# Altium project PCB_1.PrjPcb
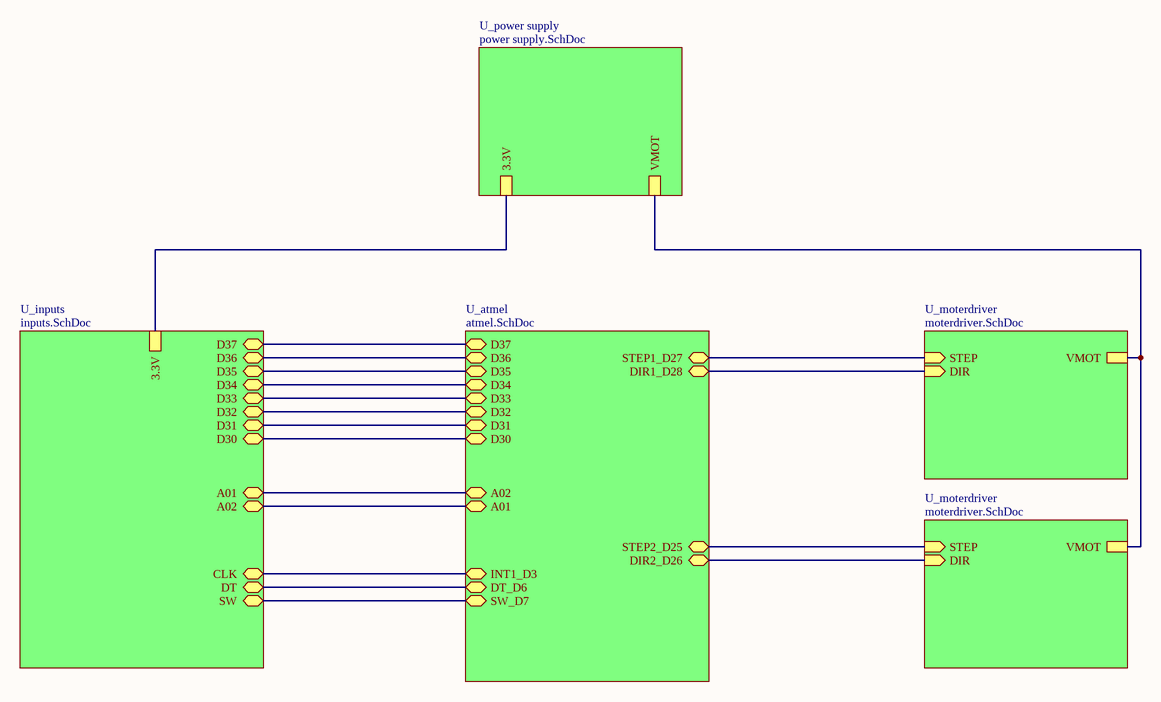
[diagram p0: Main.SchDoc]
5 sheets, 33 parts. Net scope: hierarchical (ports join the sheet entries above them; power ports are global).
Board file: PCB1.PcbDoc
Sheets:
  Main.SchDoc
    U_power supply = power supply.SchDoc
    U_atmel = atmel.SchDoc
    U_inputs = inputs.SchDoc
    U_moterdriver = moterdriver.SchDoc
    U_moterdriver = moterdriver.SchDoc

## Sheet Main.SchDoc: PCB design of fabric rolling machine
size A4; SheetNumber: 1; SheetTotal: 5

### Sub-sheets
U_atmel = atmel.SchDoc: D37 (bidir), D36 (bidir), D35 (bidir), D34 (bidir), D33 (bidir), D32 (bidir), D31 (bidir), D30 (bidir), A02 (bidir), A01 (bidir), STEP2_D25 (bidir), DIR2_D26 (bidir), STEP1_D27 (bidir), DIR1_D28 (bidir), INT1_D3 (bidir), DT_D6 (bidir), SW_D7 (bidir)
U_inputs = inputs.SchDoc: D30 (bidir), D31 (bidir), D32 (bidir), D33 (bidir), D34 (bidir), D35 (bidir), D36 (bidir), D37 (bidir), A01 (bidir), A02 (bidir), CLK (bidir), SW (bidir), 3.3V, DT (bidir)
U_moterdriver = moterdriver.SchDoc: VMOT, STEP (in), DIR (in)
U_moterdriver = moterdriver.SchDoc: VMOT, STEP (in), DIR (in)
U_power supply = power supply.SchDoc: 3.3V, VMOT

### Nets
NetC1_1: sheet U_power supply/VMOT, sheet U_moterdriver/VMOT, sheet U_moterdriver/VMOT
NetC4_1: sheet U_power supply/3.3V, sheet U_inputs/3.3V
NetEncoder_1: sheet U_atmel/INT1_D3, sheet U_inputs/CLK
NetEncoder_2: sheet U_atmel/DT_D6, sheet U_inputs/DT
NetEncoder_3: sheet U_atmel/SW_D7, sheet U_inputs/SW
NetKeyboard_1: sheet U_atmel/D30, sheet U_inputs/D30
NetKeyboard_2: sheet U_atmel/D31, sheet U_inputs/D31
NetKeyboard_3: sheet U_atmel/D32, sheet U_inputs/D32
NetKeyboard_4: sheet U_atmel/D33, sheet U_inputs/D33
NetKeyboard_5: sheet U_atmel/D34, sheet U_inputs/D34
NetKeyboard_6: sheet U_atmel/D35, sheet U_inputs/D35
NetKeyboard_7: sheet U_atmel/D36, sheet U_inputs/D36
NetKeyboard_8: sheet U_atmel/D37, sheet U_inputs/D37
NetLCD_2: sheet U_atmel/A02, sheet U_inputs/A01
NetLCD_3: sheet U_atmel/A01, sheet U_inputs/A02
NetU3_72: sheet U_atmel/DIR1_D28, sheet U_moterdriver/DIR
NetU3_73: sheet U_atmel/STEP1_D27, sheet U_moterdriver/STEP
NetU3_74: sheet U_atmel/DIR2_D26, sheet U_moterdriver/DIR
NetU3_75: sheet U_atmel/STEP2_D25, sheet U_moterdriver/STEP

## Sheet power supply.SchDoc
size A4; SheetNumber: 2; SheetTotal: 5
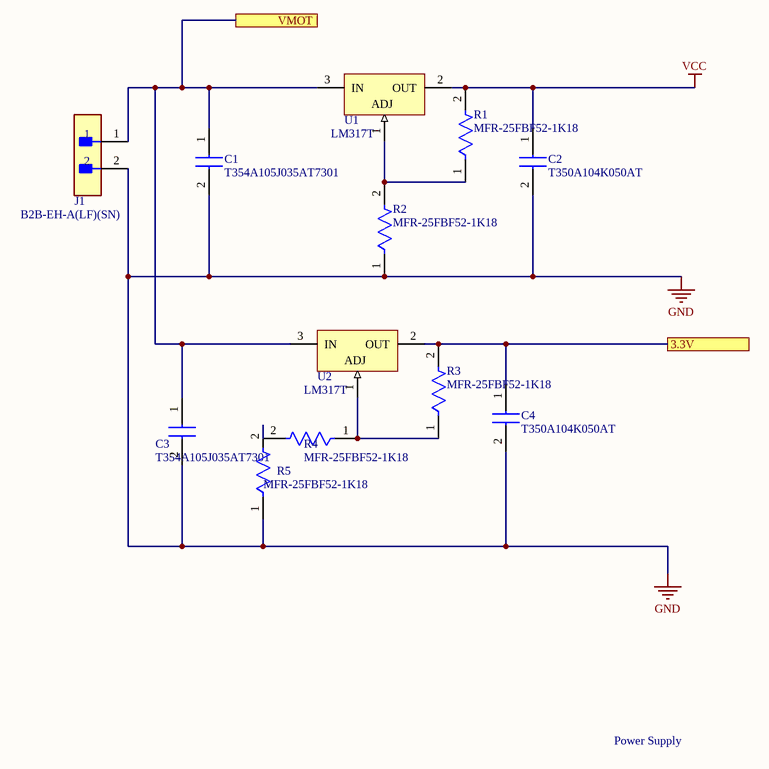
[diagram p1: power supply.SchDoc]

### Parts
C1  T354A105J035AT7301  [T354A105J035AT7301]
C2  T350A104K050AT  [T350A104K050AT]
C3  T354A105J035AT7301  [T354A105J035AT7301]
C4  T350A104K050AT  [T350A104K050AT]
J1  B2B-EH-A(LF)(SN)  [FP-B2B-EH-A_LF_SN-MFG]
R1  MFR-25FBF52-1K18  [FP-MFR-25-MFG]
R2  MFR-25FBF52-1K18  [FP-MFR-25-MFG]
R3  MFR-25FBF52-1K18  [FP-MFR-25-MFG]
R4  MFR-25FBF52-1K18  [FP-MFR-25-MFG]
R5  MFR-25FBF52-1K18  [FP-MFR-25-MFG]
U1  LM317T  [NDE0003A]
U2  LM317T  [NDE0003A]

### Ports
3.3V, VMOT

### Nets
GND: C1.2(-) C2.2 C3.2(-) C4.2 J1.2 R2.1 R5.1
VCC: C2.1 R1.2 U1.2(OUT)
NetC1_1: C1.1(+) C3.1(+) J1.1 U1.3(IN) U2.3(IN) ; port VMOT
NetC4_1: C4.1 R3.2 U2.2(OUT) ; port 3.3V
NetR1_1: R1.1 R2.2 U1.1(ADJ)
NetR3_1: R3.1 R4.1 U2.1(ADJ)
NetR4_2: R4.2 R5.2

### Notes on the sheet
- Power Supply

### Library data of the parts
C1 C3 = T354A105J035AT7301: Capacitor; Manufacturer_Name: KEMET; Datasheet Link: https://content.kemet.com/datasheets/KEM_T2043_T35X.pdf; Height: 8.6mm; Manufacturer_Part_Number: T354A105J035AT7301; Mouser Part Number: 80-T354A105J35AT-TR; Mouser Price/Stock: https://www.mouser.co.uk/ProductDetail/KEMET/T354A105J035AT7301?qs=eaG68hM7nzPCdlzS1u%252BjMg%3D%3D
C2 C4 = T350A104K050AT: Capacitor; Manufacturer_Name: KEMET; Datasheet Link: https://content.kemet.com/datasheets/KEM_T2043_T35X.pdf; Height: 7.1mm; Manufacturer_Part_Number: T350A104K050AT; Mouser Part Number: 80-T350A104K50AT; Mouser Price/Stock: https://www.mouser.co.uk/ProductDetail/KEMET/T350A104K050AT?qs=O4djsYW3Gvb%252Bsic1QYKKdw%3D%3D; Arrow Part Number: T350A104K050AT; Arrow Price/Stock: https://www.arrow.com/en/products/t350a104k050at/kemet-corporation?region=nac
J1 = CMP-17439-000026-1: CONN HEADER VERT 2POS 2.5MM; Number of Contacts: 2; Current Rating: 3A; Connector Type: Plug; Contact Resistance: 20mR; Gender: Male; Voltage Rating: 250V; Fastening Type: Detent; Depth: 3.8mm; Max Operating Temperature: 85°C; Orientation: Straight; Series: EH; Contact Plating: Tin; Min Operating Temperature: -25°C; Contact Type: Male Pin; Housing Color: White; Termination: Press-Fit; Housing Material: Nylon; Pitch: 2.5mm; Number of Positions: 2; Max Current Rating: 3A; Packaging: Bulk; Lead Free: Lead Free; Number of Rows: 1; Length: 7.5mm; Contact Mating Length: 0.13inch; Color: Natural; Max Voltage Rating (AC): 250V; Contact Material: Copper Alloy; Mount: Through Hole
R1-R5 = CMP-03413-000001-1: RES 1.18K OHM 1/4W 1% AXIAL; Manufacturer: Yageo; Value: 1.18kΩ; Temperature Coefficient: 100ppm/°C; Power Rating: 0.25W; Voltage Rating: 250V; Temperature: -55°C to +155°C; Automotive: No; Temperature Range High: +155°C; Mouser Description: Metal Film Resistors 1.18K OHM 1/4W 1%; Digikey Description: RES 1.18K OHM 1/4W 1% AXIAL; Lead Free: Yes; Tolerance: 1%; ComponentLink2Description: Datasheet; ComponentLink2URL: https://www.yageo.com/upload/media/product/products/datasheet/lr/Yageo_LR_MFR_1.pdf; Temperature Range Low: -55°C; Package: MFR-25; Ipc Land Pattern Name: RESAD1000W75L680D260; Composition: Metal Film; Category: Res; Octopart: https://octopart.com/mfr-25fbf52-1k18-yageo-56251681; Series: MFR; Device Class L2: Resistors; Height: 2.6mm; Resistance: 1.18kΩ; Device Class L3: Through-Hole Resistors; Manufacturer Part Number: MFR-25FBF52-1K18; RoHS: TRUE; Device Class L1: Passive Components
U1 U2 = CMP-0062-02456-3: 3-Terminal Adjustable Regulator, 3-pin TO-220; Manufacturer: Texas Instruments; CompType: LDO IC; PowerWise: N; PackageTopMarking: NSUZXYTTE#*LM317T P+; ComponentLink1Description: Datasheet URL; PackageReference: NDE0003A; PinCount: 3; ComponentLink1URL: http://www.ti.com/general/docs/lit/getliterature.tsp?genericPartNumber=LM317-N&fileType=pdf; RoHS: N; PackageDescription: TO-220, Molded, 3 Lead, Straight

## Sheet atmel.SchDoc
size A4; SheetNumber: 3; SheetTotal: 5
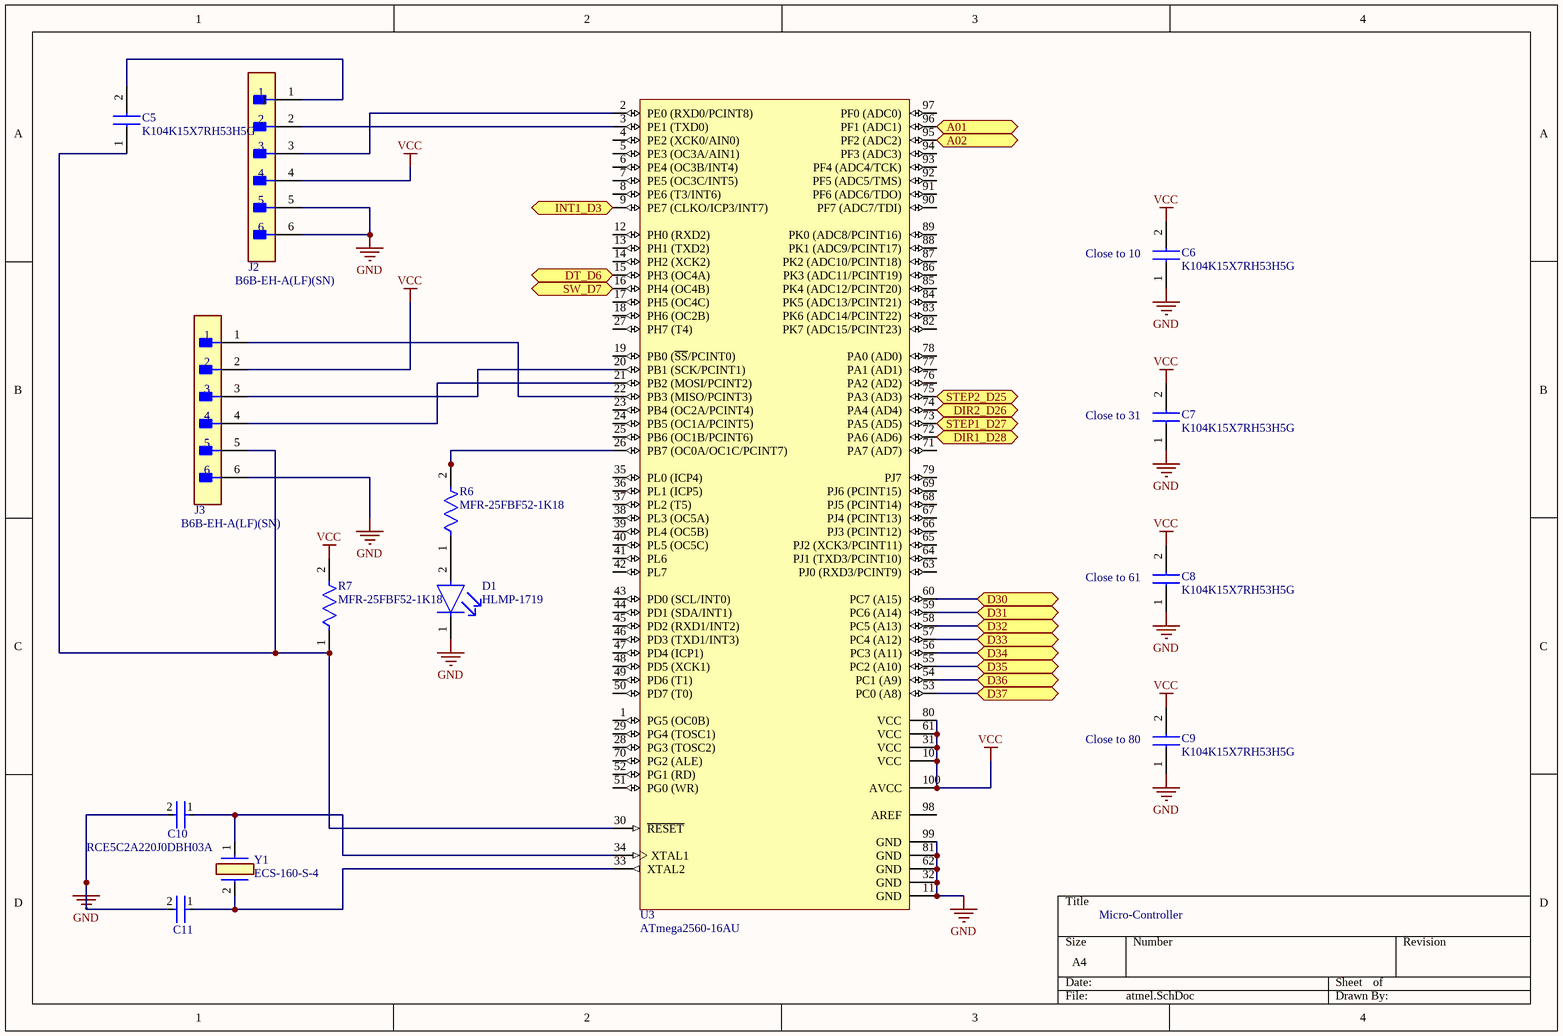
[diagram p2: atmel.SchDoc]

### Parts
C5  K104K15X7RH53H5G  [K104K15X7RH53H5G]
C6  K104K15X7RH53H5G  [K104K15X7RH53H5G]
C7  K104K15X7RH53H5G  [K104K15X7RH53H5G]
C8  K104K15X7RH53H5G  [K104K15X7RH53H5G]
C9  K104K15X7RH53H5G  [K104K15X7RH53H5G]
C10  RCE5C2A220J0DBH03A  [FP-RCE0DB-MFG]
C11  RCE5C2A220J0DBH03A  [FP-RCE0DB-MFG]  (value not drawn)
D1  HLMP-1719  [FP-HLMP-1719-MFG]
J2  B6B-EH-A(LF)(SN)  [FP-B6B-EH-A_LF_SN-MFG]
J3  B6B-EH-A(LF)(SN)  [FP-B6B-EH-A_LF_SN-MFG]
R6  MFR-25FBF52-1K18  [FP-MFR-25-MFG]
R7  MFR-25FBF52-1K18  [FP-MFR-25-MFG]
U3  ATmega2560-16AU  [100A_M]
Y1  ECS-160-S-4  [ECS160S4]

### Ports
A01 (bidir), A02 (bidir), D30 (bidir), D31 (bidir), D32 (bidir), D33 (bidir), D34 (bidir), D35 (bidir), D36 (bidir), D37 (bidir), DIR1_D28 (bidir), DIR2_D26 (bidir), DT_D6 (bidir), INT1_D3 (bidir), STEP1_D27 (bidir), STEP2_D25 (bidir), SW_D7 (bidir)

### Nets
GND: C6.1 C7.1 C8.1 C9.1 C10.2 C11.2 D1.1(C) J2.5 J2.6 J3.6 U3.11(GND) U3.32(GND) U3.62(GND) U3.81(GND) U3.99(GND)
VCC: C6.2 C7.2 C8.2 C9.2 J2.4 J3.2 R7.2 U3.10(VCC) U3.31(VCC) U3.61(VCC) U3.80(VCC) U3.100(AVCC)
NetC5_1: C5.1 J3.5 R7.1 U3.30(~{RESET})
NetC5_2: C5.2 J2.1
NetC10_1: C10.1 U3.34(XTAL1) Y1.1
NetC11_1: C11.1 U3.33(XTAL2) Y1.2
NetD1_2: D1.2(A) R6.1
NetEncoder_1: U3.9(PE7_(CLKO/ICP3/INT7)) ; port INT1_D3
NetEncoder_2: U3.15(PH3_(OC4A)) ; port DT_D6
NetEncoder_3: U3.16(PH4_(OC4B)) ; port SW_D7
NetJ2_2: J2.2 U3.3(PE1_(TXD0))
NetJ2_3: J2.3 U3.2(PE0_(RXD0/PCINT8))
NetJ3_1: J3.1 U3.22(PB3_(MISO/PCINT3))
NetJ3_3: J3.3 U3.20(PB1_(SCK/PCINT1))
NetJ3_4: J3.4 U3.21(PB2_(MOSI/PCINT2))
NetKeyboard_1: U3.60(PC7_(A15)) ; port D30
NetKeyboard_2: U3.59(PC6_(A14)) ; port D31
NetKeyboard_3: U3.58(PC5_(A13)) ; port D32
NetKeyboard_4: U3.57(PC4_(A12)) ; port D33
NetKeyboard_5: U3.56(PC3_(A11)) ; port D34
NetKeyboard_6: U3.55(PC2_(A10)) ; port D35
NetKeyboard_7: U3.54(PC1_(A9)) ; port D36
NetKeyboard_8: U3.53(PC0_(A8)) ; port D37
NetLCD_2: U3.95(PF2_(ADC2)) ; port A02
NetLCD_3: U3.96(PF1_(ADC1)) ; port A01
NetR6_2: R6.2 U3.26(PB7_(OC0A/OC1C/PCINT7))
NetU3_72: U3.72(PA6_(AD6)) ; port DIR1_D28
NetU3_73: U3.73(PA5_(AD5)) ; port STEP1_D27
NetU3_74: U3.74(PA4_(AD4)) ; port DIR2_D26
NetU3_75: U3.75(PA3_(AD3)) ; port STEP2_D25

Not connected (* = marked no-connect by the designer): U3 1(PG5_(OC0B)) 4(PE2_(XCK0/AIN0)) 5(PE3_(OC3A/AIN1)) 6(PE4_(OC3B/INT4)) 7(PE5_(OC3C/INT5)) 8(PE6_(T3/INT6)) 12(PH0_(RXD2)) 13(PH1_(TXD2)) 14(PH2_(XCK2)) 17(PH5_(OC4C)) 18(PH6_(OC2B)) 19(PB0_(~{SS}/PCINT0)) 23(PB4_(OC2A/PCINT4)) 24(PB5_(OC1A/PCINT5)) 25(PB6_(OC1B/PCINT6)) 27(PH7_(T4)) 28(PG3_(TOSC2)) 29(PG4_(TOSC1)) 35(PL0_(ICP4)) 36(PL1_(ICP5)) 37(PL2_(T5)) 38(PL3_(OC5A)) 39(PL4_(OC5B)) 40(PL5_(OC5C)) 41(PL6) 42(PL7) 43(PD0_(SCL/INT0)) 44(PD1_(SDA/INT1)) 45(PD2_(RXD1/INT2)) 46(PD3_(TXD1/INT3)) 47(PD4_(ICP1)) 48(PD5_(XCK1)) 49(PD6_(T1)) 50(PD7_(T0)) 51(PG0_(WR)) 52(PG1_(RD)) 63(PJ0_(RXD3/PCINT9)) 64(PJ1_(TXD3/PCINT10)) 65(PJ2_(XCK3/PCINT11)) 66(PJ3_(PCINT12)) 67(PJ4_(PCINT13)) 68(PJ5_(PCINT14)) 69(PJ6_(PCINT15)) 70(PG2_(ALE)) 71(PA7_(AD7)) 76(PA2_(AD2)) 77(PA1_(AD1)) 78(PA0_(AD0)) 79(PJ7) 82(PK7_(ADC15/PCINT23)) 83(PK6_(ADC14/PCINT22)) 84(PK5_(ADC13/PCINT21)) 85(PK4_(ADC12/PCINT20)) 86(PK3_(ADC11/PCINT19)) 87(PK2_(ADC10/PCINT18)) 88(PK1_(ADC9/PCINT17)) 89(PK0_(ADC8/PCINT16)) 90(PF7_(ADC7/TDI)) 91(PF6_(ADC6/TDO)) 92(PF5_(ADC5/TMS)) 93(PF4_(ADC4/TCK)) 94(PF3_(ADC3)) 97(PF0_(ADC0)) 98(AREF)

### Notes on the sheet
- (near C6) Close to 10
- (near C7) Close to 31
- (near C8) Close to 61
- (near C9) Close to 80
- Micro-Controller

### Library data of the parts
C5-C9 = K104K15X7RH53H5G: Capacitor; Manufacturer_Name: Vishay; Datasheet Link: https://www.vishay.com/docs/45250/kgseries.pdf; Height: 6.4mm; Manufacturer_Part_Number: K104K15X7RH53H5G; Mouser Part Number: 594-K104K15X7RH53H5G; Mouser Price/Stock: https://www.mouser.co.uk/ProductDetail/Vishay-BC-Components/K104K15X7RH53H5G?qs=DPoM0jnrROVmsAlOWkFXbA%3D%3D
C10 C11 = CMP-06035-047347-1: Cap Ceramic 22pF 100V C0G ±5% Radial 2.5mm +125°C Ammo Pack; Lead Diameter: 0.5mm; Lead/Base Style: Straight; Height: 3.5mm; Voltage: 100V; Mount: Through Hole; Min Operating Temperature: -55°C; Height - Seated (Max): 0.138inch; Dielectric: C0G; Width: 0.098inch; Depth: 2.5mm; Lead Pitch: 0.098inch; Packaging: Tape and Reel; Voltage Rating (DC): 100V; Capacitance: 22pF; Package Quantity: 2000; Max Operating Temperature: 125°C; Tolerance: 5%; Termination: Radial; Voltage Rating: 100V; Case/Package: Radial; Resistor Type: Ceramic; Length: 3.6mm; Ratings: AEC-Q200
D1 = CMP-2000-06410-2: LED YELLOW DIFFUSED T-1 T/H; Manufacturer: Broadcom; Wavelength: 585nm; Led Orientation: Straight; Luminous Intensity: 2.1mcd; Forward Voltage: 1.8V; Viewing Angle: 50°; Reverse Voltage: 5V; Power Dissipation: 17.5mW; Forward Current: 2mA; Lead Free: Yes; Automotive: No; Device Class L1: Optoelectronics; Mouser Description: Standard LEDs - Through Hole Yellow Diffused 585nm 2.1mcd; Digikey Description: LED YELLOW DIFFUSED T-1 T/H; Temperature: -40°C to +100°C; Temperature Range High: +100°C; Package: 0; Category: Diode; Colour: Yellow; Device Class L2: LEDs; ComponentLink2Description: Datasheet; ComponentLink2URL: https://docs.broadcom.com/docs/AV02-1557EN; Temperature Range Low: -40°C; Device Class L3: unset; Octopart: https://octopart.com/hlmp-1719-broadcom-71130405; RoHS: TRUE; Manufacturer Part Number: HLMP-1719
J2 J3 = CMP-17439-000293-1: CONN HEADER VERT 6POS 2.5MM; Voltage Rating: 250V; Number of Positions: 6; Current Rating: 3A; Mated Stacking Heights: 8.1mm; Gender: Male; Insulation Material: Nylon; Number of Contacts: 6; Contact Plating: Tin; Pitch: 2.5mm; Orientation: Straight; Insulation Color: Natural; Packaging: Bulk; Termination: Solder; Flammability Rating: UL94 V-0; Lead Free: Lead Free; Contact Mating Length: 0.13inch; Color: Natural; Contact Finish - Mating: TIN; Connector Type: Header; Contact Shape: Square; Contact Type: Male Pin; Series: EH; Contact Material: Brass; Fastening Type: Friction; Number of Rows: 1; Mount: Through Hole; Housing Color: White
R6 R7 = CMP-03413-000001-1: as R1 on sheet power supply; Temperature: -55°C to +155°C; Automotive: No; Temperature Range High: +155°C; Mouser Description: Metal Film Resistors 1.18K OHM 1/4W 1%; Digikey Description: RES 1.18K OHM 1/4W 1% AXIAL; Lead Free: Yes; Tolerance: 1%; ComponentLink2Description: Datasheet; ComponentLink2URL: https://www.yageo.com/upload/media/product/products/datasheet/lr/Yageo_LR_MFR_1.pdf; Temperature Range Low: -55°C; Package: MFR-25; Ipc Land Pattern Name: RESAD1000W75L680D260; Composition: Metal Film; Category: Res; Octopart: https://octopart.com/mfr-25fbf52-1k18-yageo-56251681; Series: MFR; Device Class L2: Resistors; Height: 2.6mm; Resistance: 1.18kΩ; Device Class L3: Through-Hole Resistors; Manufacturer Part Number: MFR-25FBF52-1K18; RoHS: TRUE; Device Class L1: Passive Components
U3 = CMP-0095-00210-2: 8-bit AVR Microcontroller, 4.5-5.5V, 16MHz, 256KB Flash, 4KB EEPROM, 8KB SRAM, 86 GPIO pins, 100-pin TQFP, Industrial Grade (-40°C to 85°C), Pb-Free; PackageDescription: 100-Pin Thin Profile Plastic Quad Flat Pack (TQFP), 14 x 14 x 1.0 mm Body, 0.5 mm Pitch; ComponentLink1Description: Manufacturer URL; ComponentLink3URL: http://www.atmel.com/dyn/resources/prod_documents/2549S.pdf; RevisionNote: DatasheetVersion & PackageVersion updated. URLs added.; DatasheetVersion: revN, May-2011; ComponentLink2Description: ATmega640/1280/1281/2560/2561 Datasheet; PackageReference: 100A; PackageVersion: revD, Oct-2010; Code_JEDEC: MS-026-AED; ComponentLink1URL: http://www.atmel.com/; ComponentLink2URL: http://www.atmel.com/dyn/resources/prod_documents/doc2549.pdf; ComponentLink3Description: ATmega640/1280/1281/2560/2561 Summary
Y1 = ECS-160-S-4: Crystal or Oscillator; Manufacturer_Name: ECS; Datasheet Link: http://www.ecsxtal.com/store/pdf/hc_49us.pdf; Height: 3.5mm; Manufacturer_Part_Number: ECS-160-S-4; Mouser Part Number: 520-HCU1600-S; Mouser Price/Stock: https://www.mouser.co.uk/ProductDetail/ECS/ECS-160-S-4?qs=CNVyLAqdhH0J%2FZuif68kGw%3D%3D

## Sheet inputs.SchDoc
size A4; SheetNumber: 4; SheetTotal: 5
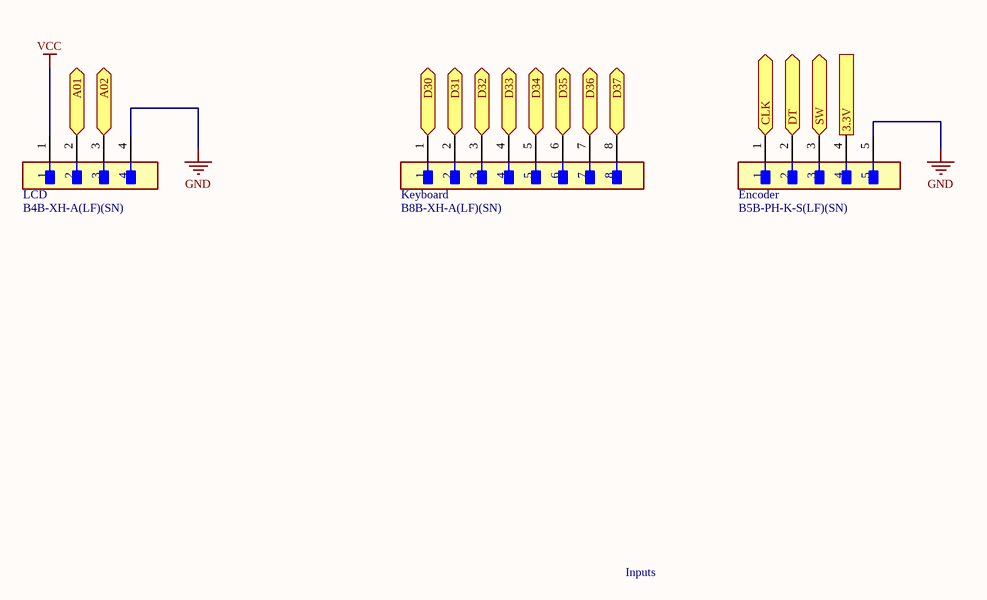
[diagram p3: inputs.SchDoc]

### Parts
Encoder  B5B-PH-K-S(LF)(SN)  [FP-B5B-PH-K-S_LF_SN-MFG]
Keyboard  B8B-XH-A(LF)(SN)  [FP-B8B-XH-A_LF_SN-MFG]
LCD  B4B-XH-A(LF)(SN)  [FP-B4B-XH-A_LF_SN-MFG]

### Ports
3.3V, A01 (bidir), A02 (bidir), CLK (bidir), D30 (bidir), D31 (bidir), D32 (bidir), D33 (bidir), D34 (bidir), D35 (bidir), D36 (bidir), D37 (bidir), DT (bidir), SW (bidir)

### Nets
GND: Encoder.5 LCD.4
VCC: LCD.1
NetC4_1: Encoder.4 ; port 3.3V
NetEncoder_1: Encoder.1 ; port CLK
NetEncoder_2: Encoder.2 ; port DT
NetEncoder_3: Encoder.3 ; port SW
NetKeyboard_1: Keyboard.1 ; port D30
NetKeyboard_2: Keyboard.2 ; port D31
NetKeyboard_3: Keyboard.3 ; port D32
NetKeyboard_4: Keyboard.4 ; port D33
NetKeyboard_5: Keyboard.5 ; port D34
NetKeyboard_6: Keyboard.6 ; port D35
NetKeyboard_7: Keyboard.7 ; port D36
NetKeyboard_8: Keyboard.8 ; port D37
NetLCD_2: LCD.2 ; port A01
NetLCD_3: LCD.3 ; port A02

### Notes on the sheet
- Inputs

### Library data of the parts
Encoder = CMP-2000-05908-2: CONN HEADER VERT 5POS 2MM; Voltage Rating (AC): 100V; Number of Positions: 5; Contact Resistance: 20mR; Insulation Resistance: 1MR; Current Rating: 2A; Gender: Male; Mated Stacking Heights: 8mm; Series: PH; Number of Poles: 5; Width: 4.5mm; Insulation Color: Natural; Fastening Type: Detent; Flammability Rating: UL94 V-0; Mount: Through Hole; Lead Free: Lead Free; Number of Rows: 1; REACH SVHC: No SVHC; Max Voltage Rating (AC): 100V; Contact Mating Length: 0.13inch; Contact Plating: Tin; Housing Material: Polyamide; Depth: 4.5mm; Contact Type: Male Pin; Voltage Rating: 100V; Color: Natural; Housing Color: White; Lead Pitch: 2mm; Number of Contacts: 5; Orientation: Straight; Packaging: Bulk; Contact Material: Brass; Pitch: 2mm; Insulation Material: Nylon; Connector Type: Header; Contact Finish - Mating: TIN; Termination: Solder; Number of Pins: 5; Length: 11.9mm; Contact Shape: Square; Max Current Rating: 2A; Working Voltage: 100V; Min Operating Temperature: -25°C; Max Operating Temperature: 85°C; Material: Polyamide; Height: 9.4mm
Keyboard = CMP-17438-000015-1: CONN HEADER VERT 8POS 2.5MM; Voltage Rating (AC): 250V; Insulation Resistance: 1GR; Connector Type: Male Pin; Max Current Rating: 3A; Wire/Cable Gauge: 22AWG; Number of Contacts: 8; Contact Resistance: 20mR; Orientation: Straight; Pitch: 2.5mm; Min Operating Temperature: -25°C; Number of Rows: 1; Contact Type: Male Pin; Packaging: Bulk; Lead Free: Lead Free; Max Operating Temperature: 85°C; Housing Material: Polyamide; Voltage Rating: 250V; Series: XH; Mount: Through Hole; Depth: 5.75mm; Contact Material: Brass; Fastening Type: Detent; Color: Natural; Max Voltage Rating (AC): 250V; Number of Positions: 8; Housing Color: White; Contact Plating: Tin; Lead Pitch: 2.5mm; Length: 22.4mm; REACH SVHC: No SVHC; Termination: Press-Fit; Current Rating: 3A
LCD = CMP-17439-000250-1: CONN HEADER VERT 4POS 2.5MM; Number of Contacts: 4; Contact Resistance: 20mR; Voltage Rating: 250V; Max Current Rating: 3A; Gender: Male; Wire/Cable Gauge: 22AWG; Mated Stacking Heights: 9.8mm; Insulation Resistance: 1GR; Orientation: Straight; Contact Type: Male Pin; Contact Finish - Mating: TIN; Series: XH; Max Voltage Rating (AC): 250V; Lead Pitch: 2.5mm; Contact Shape: Square; Insulation Color: Natural; Termination: Solder; Lead Free: Lead Free; Voltage Rating (AC): 250V; Number of Rows: 1; Flammability Rating: UL94 V-0; Number of Positions: 4; Max Operating Temperature: 85°C; Package Quantity: 500; Mount: Through Hole; REACH SVHC: No SVHC; Connector Type: Header; Insulation Material: Nylon; Fastening Type: Detent; Min Operating Temperature: -25°C; Housing Color: White; Packaging: Bulk; Contact Plating: Tin; Contact Material: Brass; Max Voltage Rating (DC): 250V; Housing Material: Polyamide; Color: Natural; Material: Polyamide; Pitch: 2.5mm; Depth: 5.75mm; Current Rating: 3A; Length: 12.4mm

## Sheet moterdriver.SchDoc
size A4; SheetNumber: 5; SheetTotal: 5
Used 2 times, as channels U_moterdriver, U_moterdriver. Parts and nets are listed once, with the designators drawn on the sheet.
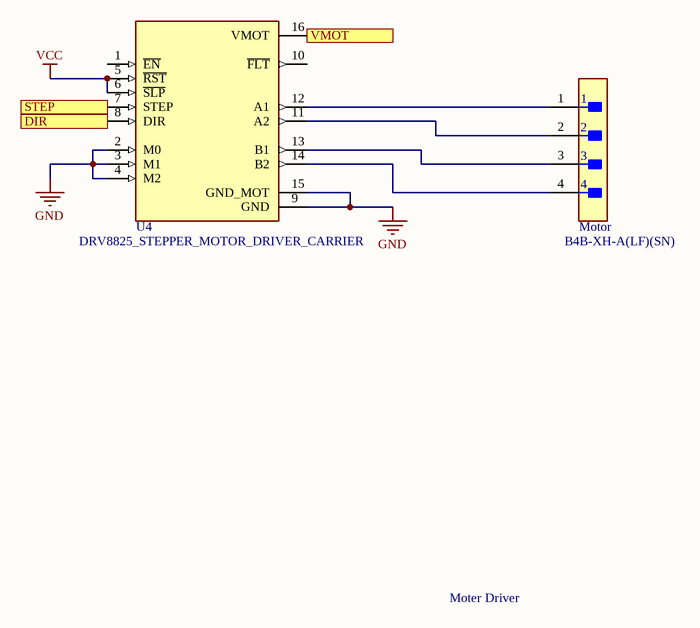
[diagram p4: moterdriver.SchDoc]

### Parts
Motor  B4B-XH-A(LF)(SN)  [FP-B4B-XH-A_LF_SN-MFG]
U4  DRV8825_STEPPER_MOTOR_DRIVER_CARRIER  [IC_DRV8825_STEPPER_MOTOR_DRIVER_CARRIER]

### Ports
DIR (in), STEP (in), VMOT

### Nets
GND: U4.2(M0) U4.3(M1) U4.4(M2) U4.9(GND) U4.15(GND_MOT)
VCC: U4.5(~{RST}) U4.6(~{SLP})
DIR: U4.8(DIR) ; port DIR
STEP: U4.7(STEP) ; port STEP
VMOT: U4.16(VMOT) ; port VMOT
NetMotor_1: Motor.1 U4.12(A1)
NetMotor_2: Motor.2 U4.11(A2)
NetMotor_3: Motor.3 U4.13(B1)
NetMotor_4: Motor.4 U4.14(B2)

Not connected (* = marked no-connect by the designer): U4 1(~{EN}) 10(~{FLT})

### Channels
U_moterdriver: designators Motor=Motor_U_moterdriver2 U4=U5; ports DIR=NetU3_72 STEP=NetU3_73 VMOT=NetC1_1
U_moterdriver: designators Motor=Motor_U_moterdriver1 U4=U4; ports DIR=NetU3_74 STEP=NetU3_75 VMOT=NetC1_1

### Notes on the sheet
- Moter Driver

### Library data of the parts
Motor = CMP-17439-000250-1: as LCD on sheet inputs; Orientation: Straight; Contact Type: Male Pin; Contact Finish - Mating: TIN; Series: XH; Max Voltage Rating (AC): 250V; Lead Pitch: 2.5mm; Contact Shape: Square; Insulation Color: Natural; Termination: Solder; Lead Free: Lead Free; Voltage Rating (AC): 250V; Number of Rows: 1; Flammability Rating: UL94 V-0; Number of Positions: 4; Max Operating Temperature: 85°C; Package Quantity: 500; Mount: Through Hole; REACH SVHC: No SVHC; Connector Type: Header; Insulation Material: Nylon; Fastening Type: Detent; Min Operating Temperature: -25°C; Housing Color: White; Packaging: Bulk; Contact Plating: Tin; Contact Material: Brass; Max Voltage Rating (DC): 250V; Housing Material: Polyamide; Color: Natural; Material: Polyamide; Pitch: 2.5mm; Depth: 5.75mm; Current Rating: 3A; Length: 12.4mm
U4 = DRV8825_STEPPER_MOTOR_DRIVER_CARRIER: Stepper motor controler; IC: DRV8825; 1.5A; Uin mot: 8.2Ã·45V; Availability: Unavailable; MP: DRV8825_STEPPER_MOTOR_DRIVER_CARRIER; Value: *; Price: None; Package: None

## Nets that join several sheets
GND: power supply (7 pins), atmel (15 pins), inputs (Encoder.5 LCD.4), U_moterdriver (5 pins), U_moterdriver (5 pins)
VCC: power supply (C2.1 R1.2 U1.2), atmel (12 pins), inputs (LCD.1), U_moterdriver (U5.5 U5.6), U_moterdriver (U4.5 U4.6)
NetC1_1: power supply (5 pins), U_moterdriver (U5.16), U_moterdriver (U4.16)
NetC4_1: power supply (C4.1 R3.2 U2.2), inputs (Encoder.4)
NetEncoder_1: atmel (U3.9), inputs (Encoder.1)
NetEncoder_2: atmel (U3.15), inputs (Encoder.2)
NetEncoder_3: atmel (U3.16), inputs (Encoder.3)
NetKeyboard_1: atmel (U3.60), inputs (Keyboard.1)
NetKeyboard_2: atmel (U3.59), inputs (Keyboard.2)
NetKeyboard_3: atmel (U3.58), inputs (Keyboard.3)
NetKeyboard_4: atmel (U3.57), inputs (Keyboard.4)
NetKeyboard_5: atmel (U3.56), inputs (Keyboard.5)
NetKeyboard_6: atmel (U3.55), inputs (Keyboard.6)
NetKeyboard_7: atmel (U3.54), inputs (Keyboard.7)
NetKeyboard_8: atmel (U3.53), inputs (Keyboard.8)
NetLCD_2: atmel (U3.95), inputs (LCD.2)
NetLCD_3: atmel (U3.96), inputs (LCD.3)
NetU3_72: atmel (U3.72), U_moterdriver (U5.8)
NetU3_73: atmel (U3.73), U_moterdriver (U5.7)
NetU3_74: atmel (U3.74), U_moterdriver (U4.8)
NetU3_75: atmel (U3.75), U_moterdriver (U4.7)